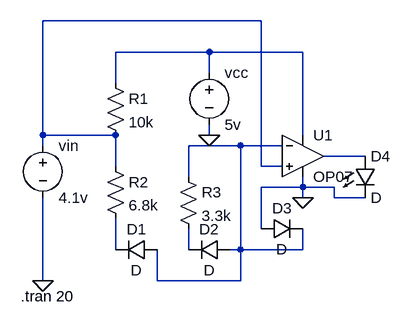
[diagram p0: schematic schematicc.asc]
schematicc.asc, the LTspice schematic file:
Version 4
SHEET 1 880 680
WIRE 320 -64 -16 -64
WIRE 240 -16 96 -16
WIRE 384 -16 240 -16
WIRE 240 16 240 -16
WIRE 96 32 96 -16
WIRE -16 112 -16 -64
WIRE 96 112 -16 112
WIRE 240 112 240 96
WIRE 384 112 384 -16
WIRE -16 128 -16 112
WIRE 288 128 208 128
WIRE 352 128 288 128
WIRE 480 144 416 144
WIRE 96 160 96 112
WIRE 320 160 320 -64
WIRE 352 160 320 160
WIRE 208 176 208 128
WIRE 384 192 384 176
WIRE 384 192 320 192
WIRE 432 192 384 192
WIRE 384 208 384 192
WIRE 432 208 432 192
WIRE 480 208 432 208
WIRE 320 256 320 192
WIRE 96 288 96 240
WIRE 208 288 208 256
WIRE 288 288 288 128
WIRE 288 288 272 288
WIRE 384 288 384 256
WIRE 384 288 288 288
WIRE -16 336 -16 208
WIRE 160 336 160 288
WIRE 288 336 288 288
WIRE 288 336 160 336
FLAG 240 112 0
FLAG -16 336 0
FLAG 384 208 0
SYMBOL voltage 240 0 R0
WINDOW 123 0 0 Left 0
WINDOW 39 0 0 Left 0
SYMATTR InstName vcc
SYMATTR Value 5v
SYMBOL voltage -16 112 R0
WINDOW 123 0 0 Left 0
WINDOW 39 0 0 Left 0
SYMATTR InstName vin
SYMATTR Value 4.1v
SYMBOL res 80 16 R0
SYMATTR InstName R1
SYMATTR Value 10k
SYMBOL res 80 144 R0
SYMATTR InstName R2
SYMATTR Value 6.8k
SYMBOL res 192 160 R0
SYMATTR InstName R3
SYMATTR Value 3.3k
SYMBOL diode 160 272 R90
WINDOW 0 0 32 VBottom 2
WINDOW 3 32 32 VTop 2
SYMATTR InstName D1
SYMBOL diode 272 272 R90
WINDOW 0 0 32 VBottom 2
WINDOW 3 32 32 VTop 2
SYMATTR InstName D2
SYMBOL diode 320 272 R270
WINDOW 0 32 32 VTop 2
WINDOW 3 0 32 VBottom 2
SYMATTR InstName D3
SYMBOL OpAmps\\OP07 384 80 R0
SYMATTR InstName U1
SYMBOL LED 464 144 R0
SYMATTR InstName D4
TEXT -50 360 Left 2 !.tran 20

The netlist it stands for:
* schematicc.asc
vcc N002 0 5v
vin N001 0 4.1v
R1 N002 N001 10k
R2 N001 N005 6.8k
R3 N003 N006 3.3k
D1 N003 N005 D
D2 N003 N006 D
D3 0 N003 D
XU1 N001 N003 N002 0 N004 LT1001  ; OP07, pins In+ In- V+ V- OUT
D4 N004 0 D
.model D D
.lib standard.dio
.tran 20
.lib LTC.lib
.backanno
.end